# EAGLE design Autopilot Control Unit rev2 (EAGLE 9.6.2)
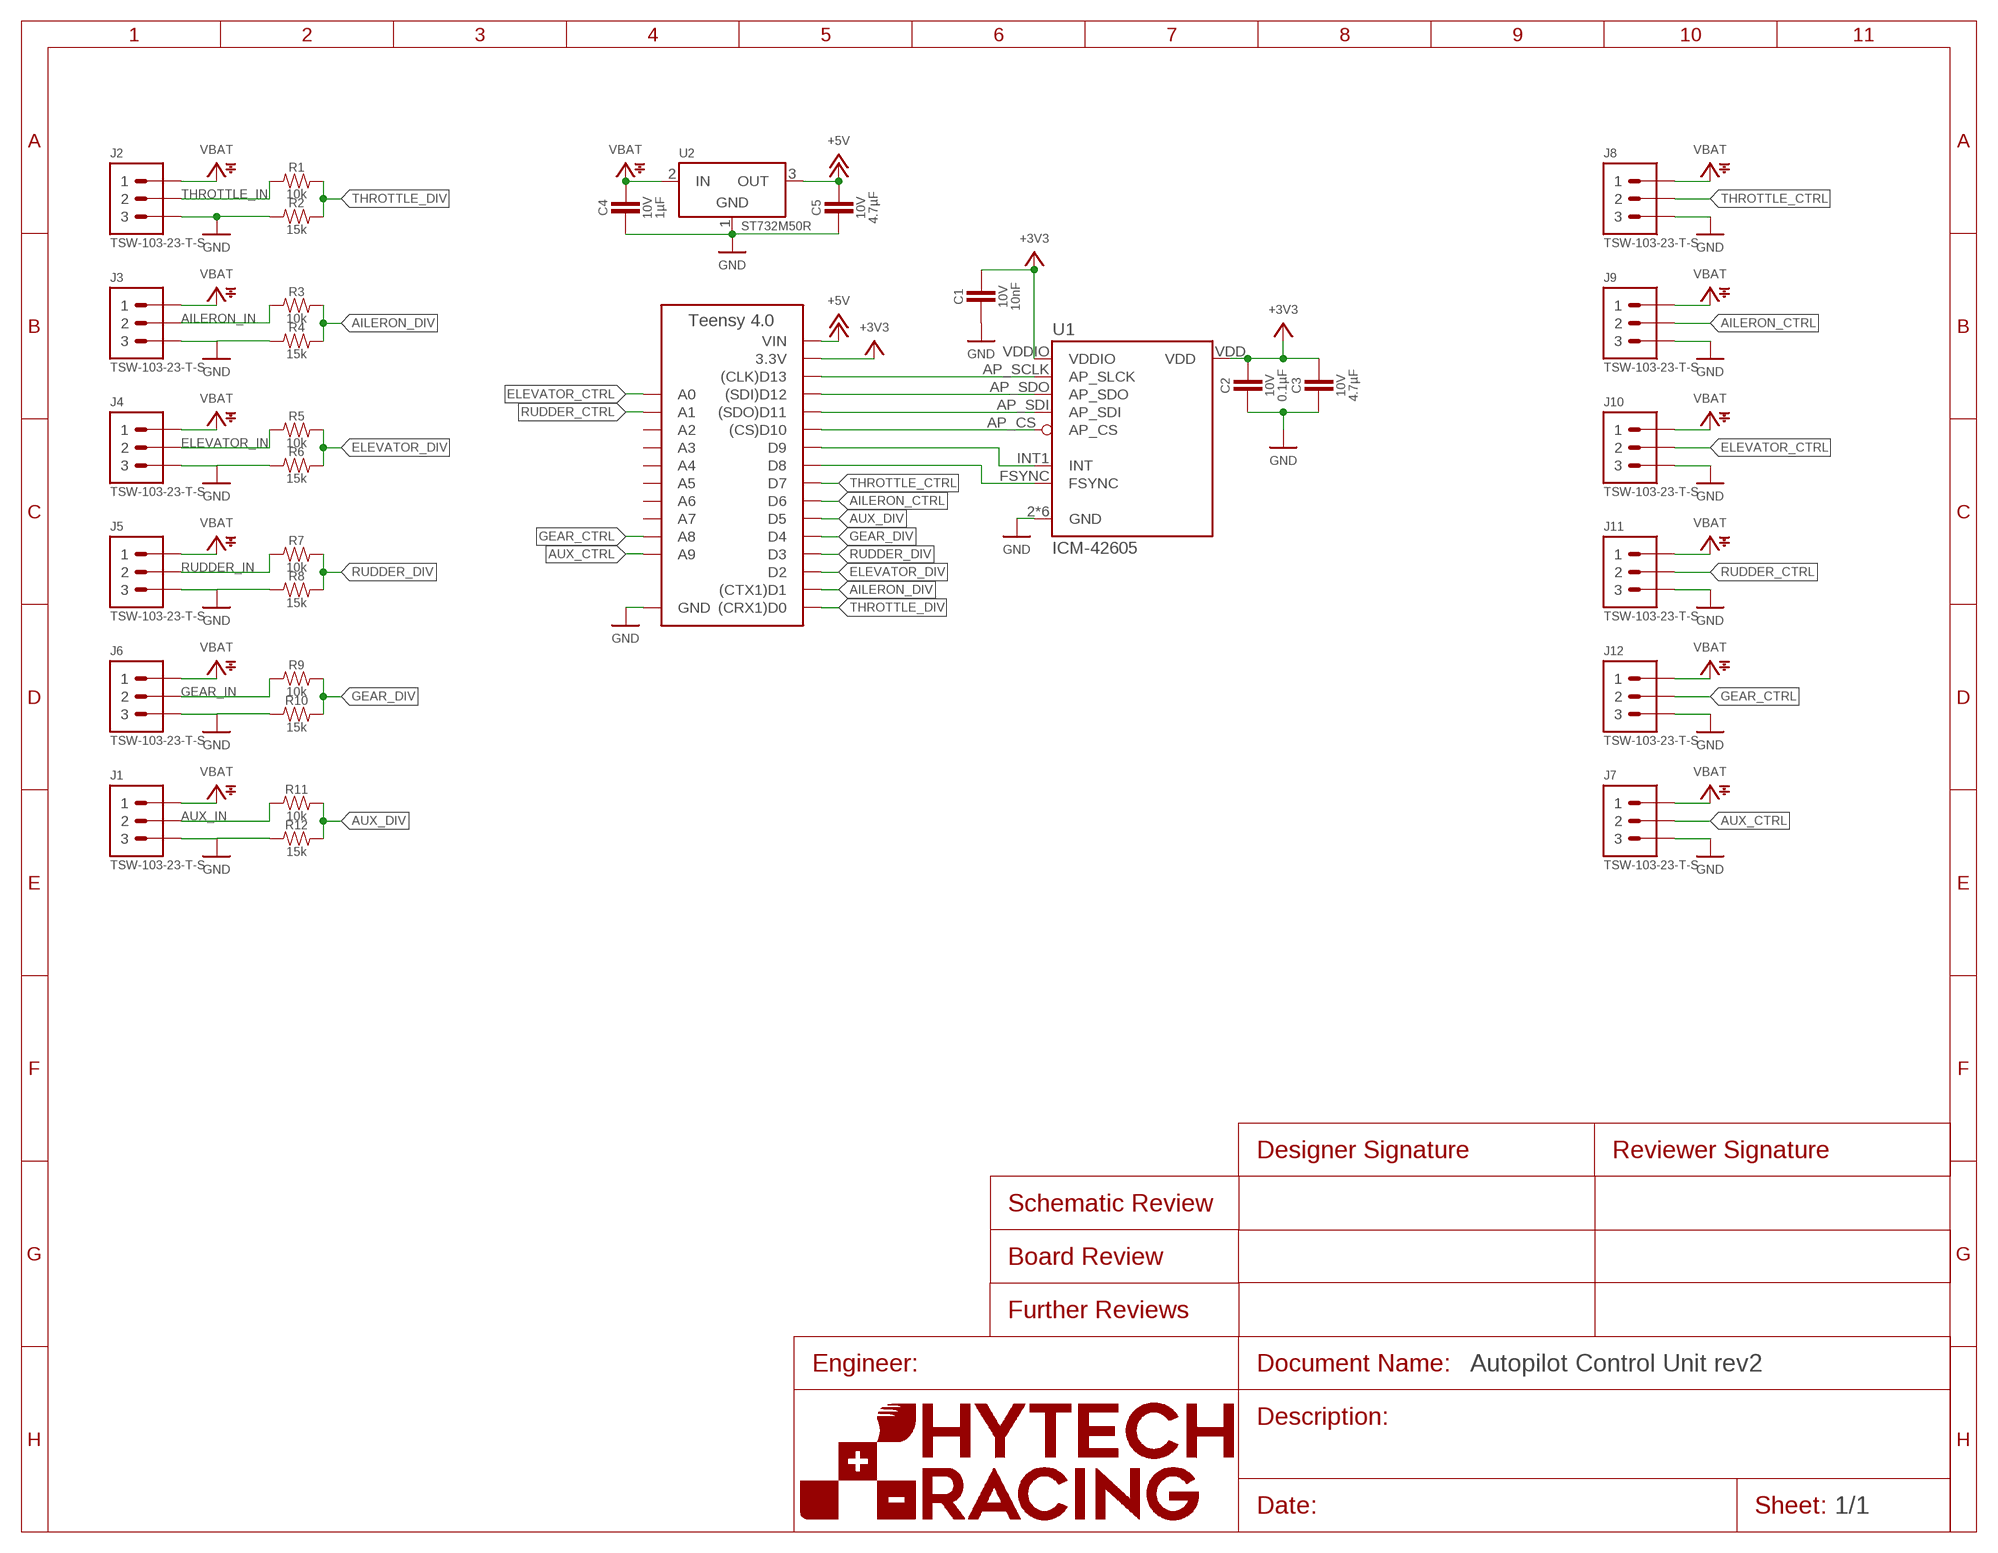
[diagram p0: schematic, sheet 1]

## Parts
A1  TEENSY_4.0  [TEENSY_SHORT]
C1  CAPACITOR_0603_10V_10NF  [0603-CAP]
C2  CAPACITOR_0603_10V_0.1UF  [0603-CAP]
C3  CAPACITOR_0603_10V_4.7UF  [0603-CAP]
C4  CAPACITOR_0603_10V_1UF  [0603-CAP]
C5  CAPACITOR_0603_10V_4.7UF  [0603-CAP]
J1  CONNECTOR_3__0.1"_INCH_TH  [0.1"_TH_HEADER]
J2  CONNECTOR_3__0.1"_INCH_TH  [0.1"_TH_HEADER]
J3  CONNECTOR_3__0.1"_INCH_TH  [0.1"_TH_HEADER]
J4  CONNECTOR_3__0.1"_INCH_TH  [0.1"_TH_HEADER]
J5  CONNECTOR_3__0.1"_INCH_TH  [0.1"_TH_HEADER]
J6  CONNECTOR_3__0.1"_INCH_TH  [0.1"_TH_HEADER]
J7  CONNECTOR_3__0.1"_INCH_TH  [0.1"_TH_HEADER]
J8  CONNECTOR_3__0.1"_INCH_TH  [0.1"_TH_HEADER]
J9  CONNECTOR_3__0.1"_INCH_TH  [0.1"_TH_HEADER]
J10  CONNECTOR_3__0.1"_INCH_TH  [0.1"_TH_HEADER]
J11  CONNECTOR_3__0.1"_INCH_TH  [0.1"_TH_HEADER]
J12  CONNECTOR_3__0.1"_INCH_TH  [0.1"_TH_HEADER]
R1  RESISTOR_0603_10K  [0603-RES]
R2  RESISTOR_0603_15K  [0603-RES]
R3  RESISTOR_0603_10K  [0603-RES]
R4  RESISTOR_0603_15K  [0603-RES]
R5  RESISTOR_0603_10K  [0603-RES]
R6  RESISTOR_0603_15K  [0603-RES]
R7  RESISTOR_0603_10K  [0603-RES]
R8  RESISTOR_0603_15K  [0603-RES]
R9  RESISTOR_0603_10K  [0603-RES]
R10  RESISTOR_0603_15K  [0603-RES]
R11  RESISTOR_0603_10K  [0603-RES]
R12  RESISTOR_0603_15K  [0603-RES]
U1  ICM-42605  [ICM-42605]
U2  VOLTAGE_REGULATOR_SOT-23-5_5V  [SOT-23-5]

## Nets
+3V3: A1.3.3V C1.1 C2.1 C3.1 U1.VDD U1.VDDIO
+5V: A1.VIN C5.1 U2.3(OUT)
AILERON_CTRL: A1.D6 J9.2
AILERON_DIV: A1.D1((CTX1)D1) R3.2 R4.2
AILERON_IN: J3.2 R3.1
AUX_CTRL: A1.D23(A9) J7.2
AUX_DIV: A1.D5 R11.2 R12.2
AUX_IN: J1.2 R11.1
ELEVATOR_CTRL: A1.D14(A0) J10.2
ELEVATOR_DIV: A1.D2 R5.2 R6.2
ELEVATOR_IN: J4.2 R5.1
GEAR_CTRL: A1.D22(A8) J12.2
GEAR_DIV: A1.D4 R9.2 R10.2
GEAR_IN: J6.2 R9.1
GND: A1.AGND/GND(GND) A1.GND C1.2 C2.2 C3.2 C4.2 C5.2 J1.3 J2.3 J3.3 J4.3 J5.3 J6.3 J7.3 J8.3 J9.3 J10.3 J11.3 J12.3 R2.1 R4.1 R6.1 R8.1 R10.1 R12.1 U1.2(GND) U1.3(GND) U1.7(GND) U1.10(GND) U1.11(GND) U1.GND U2.1(GND)
N$1: A1.D13((CLK)D13) U1.AP_SCLK(AP_SLCK)
N$2: A1.D12((SDI)D12) U1.AP_SDO
N$3: A1.D11((SDO)D11) U1.AP_SDI
N$4: A1.D10((CS)D10) U1.AP_CS
N$7: A1.D9 U1.INT1(INT)
N$8: A1.D8 U1.FSYNC
RUDDER_CTRL: A1.D15(A1) J11.2
RUDDER_DIV: A1.D3 R7.2 R8.2
RUDDER_IN: J5.2 R7.1
THROTTLE_CTRL: A1.D7 J8.2
THROTTLE_DIV: A1.D0((CRX1)D0) R1.2 R2.2
THROTTLE_IN: J2.2 R1.1
VBAT: C4.1 J1.1 J2.1 J3.1 J4.1 J5.1 J6.1 J7.1 J8.1 J9.1 J10.1 J11.1 J12.1 U2.2(IN)
Unconnected: A1.D16(A2) A1.D17(A3) A1.D18(A4) A1.D19(A5) A1.D20(A6) A1.D21(A7)

## Library data of the parts
A1 = HyTechDevices:TEENSY_4.0: Teensy 4.0 Datasheet <https://www.pjrc.com/store/teensy40.html> Requires ordering of: 2: 14 pin, 0.1" pitch female headers; TEENSY: 4.0
C1 = HyTechDevices:CAPACITOR_?_*: Capacitor, Non-Polarized VJ...1BC Series Datasheet <https://www.mouser.com/datasheet/2/427/vjw1bcbascomseries-1762447.pdf> Samsung Datasheet <https://www.mouser.com/datasheet/2/585/MLCC-1837944.pdf> Walsin Datasheet <https://www.mouser.com/datasheet/2/210/WTC_MLCC_General_Purpose-1534899.pdf> GRM188R61A226ME15D <https://www.mouser.com/datasheet/2/281/1/GRM188R61A226ME15_02A-1985787.pdf> GRM188R61E106MA73D <https://www.mouser.com/datasheet/2/281/1/GRM188R61E106MA73_01A-1985806.pdf> 885012006013 <https://www.mouser.com/datasheet/2/445/885012006013-1726946.pdf> 2220Y6300105KXTWS2 <https://www.mouser.com/datasheet/2/218/SMD_High_and_Std_StackiCap_P62-1825512.pdf> Yageo Class 2, X5R <https://www.mouser.com/datasheet/2/447/UPY_GPHC_X5R_4V_to_50V_26-1827097.pdf> TDK C Series <https://www.mouser.com/ProductDetail/TDK/C3216X5R1V226M160AC?qs=%2Fha2pyFadujbcx9jh7lYl%2F4NeMoXFhdc8AqVWNq4wW6M2y7zl6GzBuhgtI0ngznN> AVX Automotive MLCC <https://www.mouser.com/datasheet/2/40/AutoMLCC-777028.pdf> KEMET X7R Series <https://www.mouser.com/datasheet/2/212/KEM_C1002_X7R_SMD-1102033.pdf> Kyocera AVX <https://www.mouser.com/datasheet/2/40/C0GNP0_Dielectric-951274.pdf> GRM21BR61H <https://www.mouser.com/datasheet/2/281/1/GRM21BR61H106KE43_01A-1986884.pdf>; CAPACITANCE: 10nF; DKPN: 311-4054-1-ND; MANUFACTURER: Yageo; MOPN: 603-CC603KRX7R6BB103; MPN: CC0603KRX7R6BB103; TOLERANCE: 10%; VOLTAGE: 10V
C2 = HyTechDevices:CAPACITOR_?_*: Capacitor, Non-Polarized VJ...1BC Series Datasheet <https://www.mouser.com/datasheet/2/427/vjw1bcbascomseries-1762447.pdf> Samsung Datasheet <https://www.mouser.com/datasheet/2/585/MLCC-1837944.pdf> Walsin Datasheet <https://www.mouser.com/datasheet/2/210/WTC_MLCC_General_Purpose-1534899.pdf> GRM188R61A226ME15D <https://www.mouser.com/datasheet/2/281/1/GRM188R61A226ME15_02A-1985787.pdf> GRM188R61E106MA73D <https://www.mouser.com/datasheet/2/281/1/GRM188R61E106MA73_01A-1985806.pdf> 885012006013 <https://www.mouser.com/datasheet/2/445/885012006013-1726946.pdf> 2220Y6300105KXTWS2 <https://www.mouser.com/datasheet/2/218/SMD_High_and_Std_StackiCap_P62-1825512.pdf> Yageo Class 2, X5R <https://www.mouser.com/datasheet/2/447/UPY_GPHC_X5R_4V_to_50V_26-1827097.pdf> TDK C Series <https://www.mouser.com/ProductDetail/TDK/C3216X5R1V226M160AC?qs=%2Fha2pyFadujbcx9jh7lYl%2F4NeMoXFhdc8AqVWNq4wW6M2y7zl6GzBuhgtI0ngznN> AVX Automotive MLCC <https://www.mouser.com/datasheet/2/40/AutoMLCC-777028.pdf> KEMET X7R Series <https://www.mouser.com/datasheet/2/212/KEM_C1002_X7R_SMD-1102033.pdf> Kyocera AVX <https://www.mouser.com/datasheet/2/40/C0GNP0_Dielectric-951274.pdf> GRM21BR61H <https://www.mouser.com/datasheet/2/281/1/GRM21BR61H106KE43_01A-1986884.pdf>; CAPACITANCE: 0.1µF; DKPN: 720-1688-1-ND; MANUFACTURER: Vishay Vitramon; MOPN: 77-VJ0603Y104JXQPBC; MPN: VJ0603Y104JXQPW1BC; TOLERANCE: 5%; VOLTAGE: 10V
C3 C5 = HyTechDevices:CAPACITOR_?_*: Capacitor, Non-Polarized VJ...1BC Series Datasheet <https://www.mouser.com/datasheet/2/427/vjw1bcbascomseries-1762447.pdf> Samsung Datasheet <https://www.mouser.com/datasheet/2/585/MLCC-1837944.pdf> Walsin Datasheet <https://www.mouser.com/datasheet/2/210/WTC_MLCC_General_Purpose-1534899.pdf> GRM188R61A226ME15D <https://www.mouser.com/datasheet/2/281/1/GRM188R61A226ME15_02A-1985787.pdf> GRM188R61E106MA73D <https://www.mouser.com/datasheet/2/281/1/GRM188R61E106MA73_01A-1985806.pdf> 885012006013 <https://www.mouser.com/datasheet/2/445/885012006013-1726946.pdf> 2220Y6300105KXTWS2 <https://www.mouser.com/datasheet/2/218/SMD_High_and_Std_StackiCap_P62-1825512.pdf> Yageo Class 2, X5R <https://www.mouser.com/datasheet/2/447/UPY_GPHC_X5R_4V_to_50V_26-1827097.pdf> TDK C Series <https://www.mouser.com/ProductDetail/TDK/C3216X5R1V226M160AC?qs=%2Fha2pyFadujbcx9jh7lYl%2F4NeMoXFhdc8AqVWNq4wW6M2y7zl6GzBuhgtI0ngznN> AVX Automotive MLCC <https://www.mouser.com/datasheet/2/40/AutoMLCC-777028.pdf> KEMET X7R Series <https://www.mouser.com/datasheet/2/212/KEM_C1002_X7R_SMD-1102033.pdf> Kyocera AVX <https://www.mouser.com/datasheet/2/40/C0GNP0_Dielectric-951274.pdf> GRM21BR61H <https://www.mouser.com/datasheet/2/281/1/GRM21BR61H106KE43_01A-1986884.pdf>; CAPACITANCE: 4.7µF; DKPN: 1276-1044-1-ND; MANUFACTURER: Samsung Electro-Mechanics; MOPN: 187-CL10A475KP8NNNC; MPN: CL10A475KP8NNNC; TOLERANCE: 10%; VOLTAGE: 10V
C4 = HyTechDevices:CAPACITOR_?_*: Capacitor, Non-Polarized VJ...1BC Series Datasheet <https://www.mouser.com/datasheet/2/427/vjw1bcbascomseries-1762447.pdf> Samsung Datasheet <https://www.mouser.com/datasheet/2/585/MLCC-1837944.pdf> Walsin Datasheet <https://www.mouser.com/datasheet/2/210/WTC_MLCC_General_Purpose-1534899.pdf> GRM188R61A226ME15D <https://www.mouser.com/datasheet/2/281/1/GRM188R61A226ME15_02A-1985787.pdf> GRM188R61E106MA73D <https://www.mouser.com/datasheet/2/281/1/GRM188R61E106MA73_01A-1985806.pdf> 885012006013 <https://www.mouser.com/datasheet/2/445/885012006013-1726946.pdf> 2220Y6300105KXTWS2 <https://www.mouser.com/datasheet/2/218/SMD_High_and_Std_StackiCap_P62-1825512.pdf> Yageo Class 2, X5R <https://www.mouser.com/datasheet/2/447/UPY_GPHC_X5R_4V_to_50V_26-1827097.pdf> TDK C Series <https://www.mouser.com/ProductDetail/TDK/C3216X5R1V226M160AC?qs=%2Fha2pyFadujbcx9jh7lYl%2F4NeMoXFhdc8AqVWNq4wW6M2y7zl6GzBuhgtI0ngznN> AVX Automotive MLCC <https://www.mouser.com/datasheet/2/40/AutoMLCC-777028.pdf> KEMET X7R Series <https://www.mouser.com/datasheet/2/212/KEM_C1002_X7R_SMD-1102033.pdf> Kyocera AVX <https://www.mouser.com/datasheet/2/40/C0GNP0_Dielectric-951274.pdf> GRM21BR61H <https://www.mouser.com/datasheet/2/281/1/GRM21BR61H106KE43_01A-1986884.pdf>; CAPACITANCE: 1µF; DKPN: 311-1796-1-ND; MANUFACTURER: Yageo; MOPN: 603-CC603KRX7R6BB105; MPN: CC0603KRX7R6BB105; TOLERANCE: 10%; VOLTAGE: 10V
J1-J12 = Devices:CONNECTOR_3_?_*; MPN: TSW-103-23-T-S
R1 R3 R5 R7 R9 R11 = HyTechDevices:RESISTOR_?_*: Resistor PWR163 Series <https://www.mouser.com/datasheet/2/54/pwr163-777985.pdf> AC Series <https://www.mouser.com/datasheet/2/447/Yageo_PYu_AC_51_RoHS_L_7_1714230-1874691.pdf> PU Series <https://www.mouser.com/datasheet/2/447/PYu-PU_51_RoHS_L_6-1504619.pdf> ERA Series <https://www.mouser.com/datasheet/2/315/AOA0000C307-1149632.pdf> PWR263 Series <https://www.mouser.com/datasheet/2/54/pwr263s_35-778069.pdf> KTR Series <https://www.mouser.com/datasheet/2/348/ROHM_S_A0011075115_1-2563276.pdf> RC Series <https://www.mouser.com/datasheet/2/447/Yageo_03_18_2021_PYu_RC_Group_51_RoHS_L_11-2199992.pdf> ERJ PB3, PB6 Series <https://www.mouser.com/datasheet/2/315/AOA0000C328-1530132.pdf> ERJ PA2, P03, PA3, P06, P08, P14 Series <https://www.mouser.com/datasheet/2/315/AOA0000C331-1141874.pdf> B20 Series <https://www.ohmite.com/assets/docs/res_200.pdf?r=false> TE Connectivity/Holsworthy RN73 Series <https://www.mouser.com/datasheet/2/418/4/NG_DS_1773270_M-604713.pdf> Vishay Dale D/CRCW e3 <https://www.mouser.com/datasheet/2/427/dcrcwe3-1762152.pdf> Ohmite B20 <https://www.ohmite.com/assets/docs/res_200.pdf?r=false>; DKPN: 311-10.0KHRCT-ND; MANUFACTURER: Yageo; MOPN: 603-RC0603FR-0710KL; MPN: RC0603FR-0710KL; POWER: 0.1W; RESISTANCE: 10k; TOLERANCE: 1%; VOLTAGE_CONTINUOUS: 31.62V; VOLTAGE_MAX: 75V
R2 R4 R6 R8 R10 R12 = HyTechDevices:RESISTOR_?_*: Resistor PWR163 Series <https://www.mouser.com/datasheet/2/54/pwr163-777985.pdf> AC Series <https://www.mouser.com/datasheet/2/447/Yageo_PYu_AC_51_RoHS_L_7_1714230-1874691.pdf> PU Series <https://www.mouser.com/datasheet/2/447/PYu-PU_51_RoHS_L_6-1504619.pdf> ERA Series <https://www.mouser.com/datasheet/2/315/AOA0000C307-1149632.pdf> PWR263 Series <https://www.mouser.com/datasheet/2/54/pwr263s_35-778069.pdf> KTR Series <https://www.mouser.com/datasheet/2/348/ROHM_S_A0011075115_1-2563276.pdf> RC Series <https://www.mouser.com/datasheet/2/447/Yageo_03_18_2021_PYu_RC_Group_51_RoHS_L_11-2199992.pdf> ERJ PB3, PB6 Series <https://www.mouser.com/datasheet/2/315/AOA0000C328-1530132.pdf> ERJ PA2, P03, PA3, P06, P08, P14 Series <https://www.mouser.com/datasheet/2/315/AOA0000C331-1141874.pdf> B20 Series <https://www.ohmite.com/assets/docs/res_200.pdf?r=false> TE Connectivity/Holsworthy RN73 Series <https://www.mouser.com/datasheet/2/418/4/NG_DS_1773270_M-604713.pdf> Vishay Dale D/CRCW e3 <https://www.mouser.com/datasheet/2/427/dcrcwe3-1762152.pdf> Ohmite B20 <https://www.ohmite.com/assets/docs/res_200.pdf?r=false>; DKPN: P15KBDCT-ND; MANUFACTURER: Panasonic Electronic Components; MOPN: 667-ERA-3ARB153V; MPN: ERA-3ARB153V; POWER: 0.1W; RESISTANCE: 15k; TOLERANCE: 0.1%; VOLTAGE_CONTINUOUS: 38.73V; VOLTAGE_MAX: 75V
U1 = Devices:ICM-42605; MPN: ICM-42605
U2 = HyTechDevices:VOLTAGE_REGULATOR_?_*: Voltage Regulators LDL1117S50R Datasheet <https://www.mouser.com/datasheet/2/389/dm00366442-1799212.pdf> NCP785AH120T1G <https://www.mouser.com/datasheet/2/308/NCP785A_D-1812704.pdf> LMS8117A Datasheet <https://www.ti.com/lit/ds/symlink/lms8117a.pdf?HQS> ST732M50R Datasheet <https://www.mouser.com/datasheet/2/389/st732-1830546.pdf>; DKPN: 497-ST732M50RTR-ND; MANUFACTURER: STMicroelectronics; MOPN: 511-ST732M50R; MPN: ST732M50R

## Board
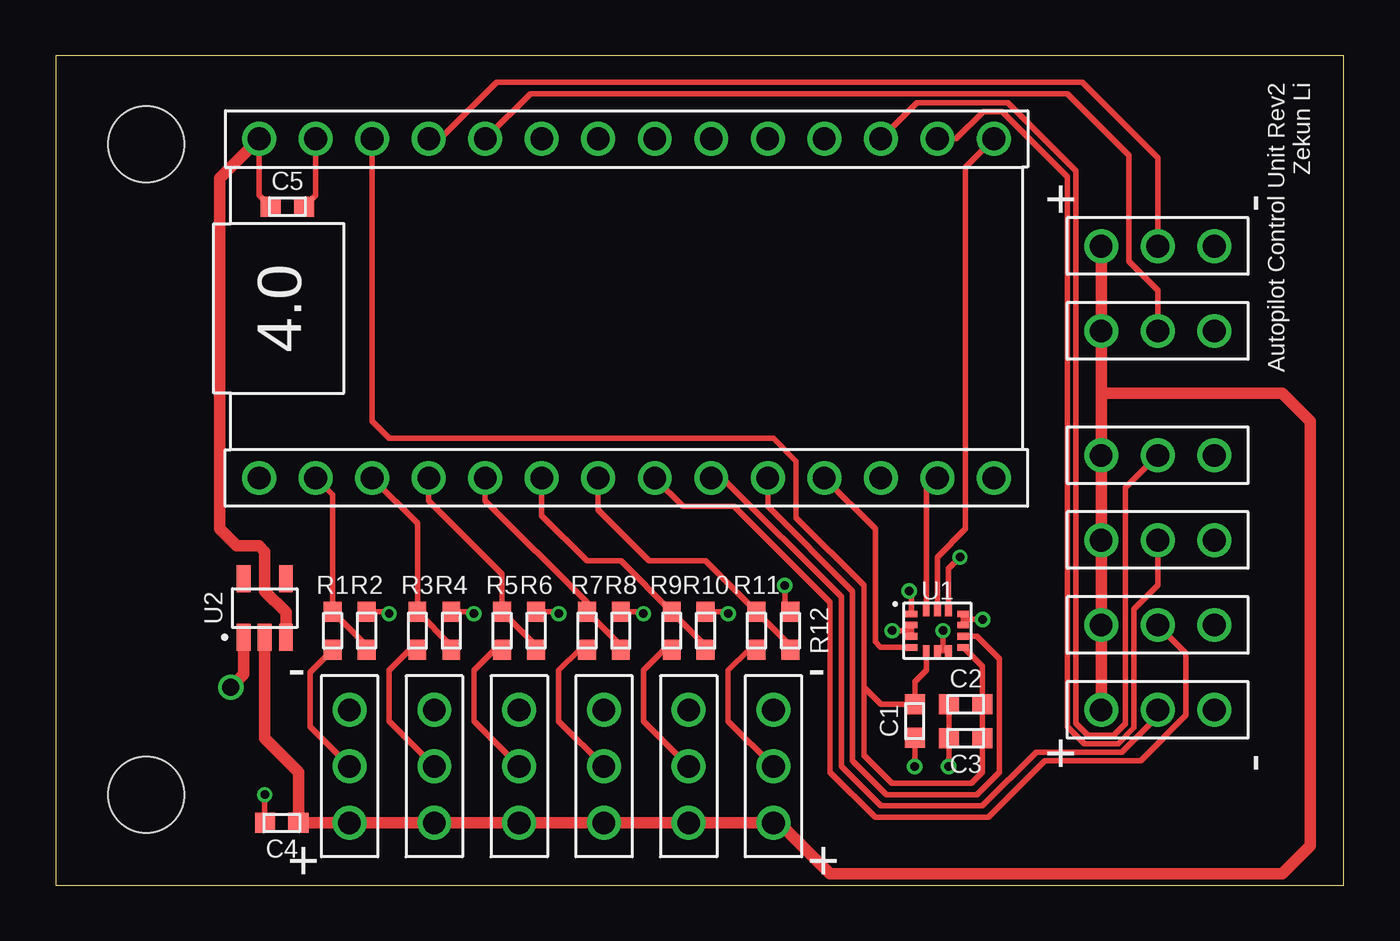
[diagram p1: board, top side]
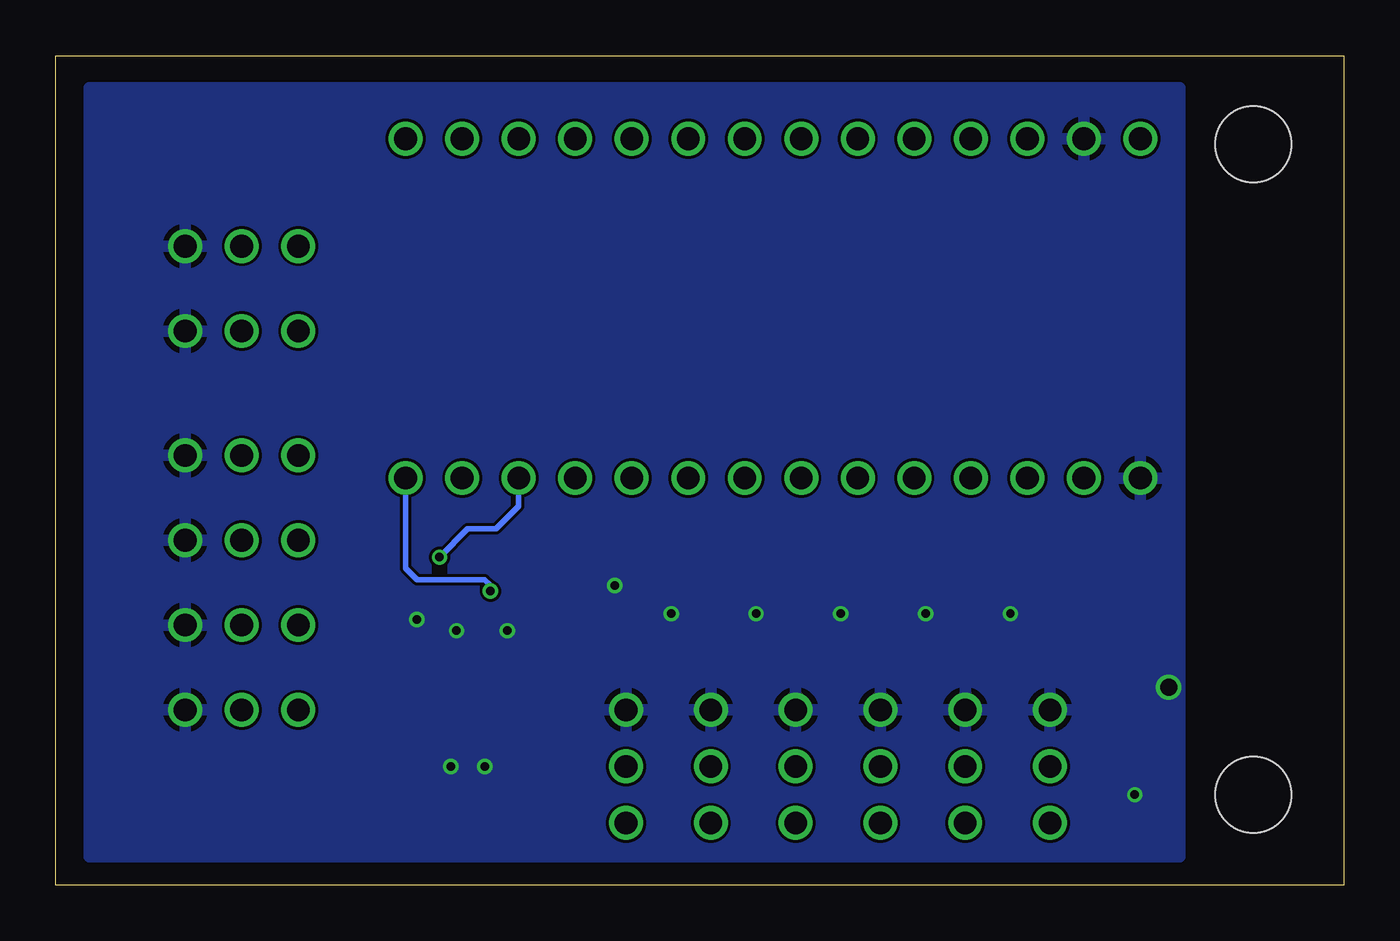
[diagram p2: board, bottom side, seen from below]

Size 57.89 x 37.26 mm. Coordinates in mm from the lower left corner, seen from the top.
Outline: 0,0 57.89,0 57.89,37.26 0,37.26 0,0
Copper layers (1*16): Top 0.035mm / dielectric 1.53mm / Bottom 0.035mm
Design rules "JLCPCB (2 Layer)": minimum track width 5mil, minimum drill 0.3mm, track to track 5mil, track to pad 5mil, pad to pad 5mil, via to via 20mil, smd to smd 5mil, copper to edge 0.2mm, drill to drill 21mil, minimum pad ring 6mil, minimum via ring 6mil, stop-mask expansion 6mil, vias tented up to drill 30mil, thermal gap 10mil

### Footprints (pad centres in the part's own frame; a part is rotated, then mirrored left to right if it is on the bottom)
TEENSY_SHORT = drill 1.016: 3.3V 0,5.08; AGND/GND 0,2.54; D0 15.24,2.54; D1 15.24,5.08; D2 15.24,7.62; D3 15.24,10.16; D4 15.24,12.7; D5 15.24,15.24; D6 15.24,17.78; D7 15.24,20.32; D8 15.24,22.86; D9 15.24,25.4; D10 15.24,27.94; D11 15.24,30.48; D12 15.24,33.02; D13 0,33.02; D14 0,30.48; D15 0,27.94; D16 0,25.4; D17 0,22.86; D18 0,20.32; D19 0,17.78; D20 0,15.24; D21 0,12.7; D22 0,10.16; D23 0,7.62; GND 15.24,0; VIN 0,0
0603-CAP = smd 0.9 x 0.9: 1 -0.75,0; 2 0.75,0
0.1"_TH_HEADER = drill 1.016: 1 0,2.54; 2 0,0; 3 0,-2.54
0603-RES = smd 0.9 x 0.8: 1 -0.85,0; 2 0.85,0
ICM-42605 = smd 0.525 x 0.3: 2 -1.163,0.25; 3 -1.163,-0.25; 10 1.163,0.25; 11 1.163,0.75; AP_SDO -1.163,0.75; FSYNC 1.163,-0.25; INT1 -1.163,-0.75; VDD 1.163,-0.75 | smd 0.3 x 0.525: 7 0.5,-0.912; AP_CS 0.5,0.912; AP_SCLK 0,0.912; AP_SDI -0.5,0.912; GND 0,-0.912; VDDIO -0.5,-0.912
SOT-23-5 = smd 0.62 x 1.22: 1 -0.95,-1.31; 2 0,-1.31; 3 0.95,-1.31; 4 0.95,1.31; 5 -0.95,1.31
MOUNTING_M3 = hole 3.4: 0,0

### Placement (x,y rotation side)
A1  9.14,33.53 270 top
C1  38.61,7.37 270 top
C2  40.89,8.13 180 top
C3  40.89,6.6 180 top
C4  10.16,2.79 180 top
C5  10.41,30.48 0 top
J1  32.26,5.33 180 top
J2  13.21,5.33 180 top
J3  17.02,5.33 180 top
J4  20.83,5.33 180 top
J5  24.64,5.33 180 top
J6  28.45,5.33 180 top
J7  49.53,28.7 90 top
J8  49.53,7.87 90 top
J9  49.53,11.68 90 top
J10  49.53,15.49 90 top
J11  49.53,19.3 90 top
J12  49.53,24.89 90 top
R1  12.45,11.43 90 top
R2  13.97,11.43 270 top
R3  16.26,11.43 90 top
R4  17.78,11.43 270 top
R5  20.07,11.43 90 top
R6  21.59,11.43 270 top
R7  23.88,11.43 90 top
R8  25.4,11.43 270 top
R9  27.69,11.43 90 top
R10  29.21,11.43 270 top
R11  31.5,11.43 90 top
R12  33.02,11.43 270 top
U1  39.62,11.43 0 top
U2  9.4,12.45 0 top
U$1  [MOUNTING_M3]  4.06,4.06 0 top
U$2  [MOUNTING_M3]  4.06,33.27 0 top

### Tracks (layer width: path | path; a pad name or v marks a point on that pad's centre or on a via)
+3V3
  Top 0.254: U1.VDDIO 39.12,9.65 38.61,9.13 C1.1 37.1,8.12 36.32,8.89 | U1.VDD 41.64,9.82 C2.1 C3.1 41.64,5.07 41.15,4.57 37.59,4.57 36.32,5.84 36.32,8.89 | A1.3.3V 14.22,20.83 14.99,20.07 32.26,20.07 33.27,19.05 33.27,16.51 36.32,13.46 36.32,8.89
+5V
  Top 0.254: A1.VIN 9.14,31 C5.1
  Top 0.508: U2.3 10.35,12.26 9.4,13.21 9.4,14.99 9.14,15.24 8.13,15.24 7.37,16 7.37,31.75 A1.VIN
AILERON_CTRL
  Top 0.254: A1.D6 28.19,17.02 30.48,17.02 34.8,12.7 34.8,5.08 36.83,3.05 41.91,3.05 44.45,5.59 48.77,5.59 50.8,7.62 50.8,10.41 J9.2
AILERON_DIV
  Top 0.254: R4.2 17.78,10.76 R3.2 16.26,16.26 A1.D1
AILERON_IN
  Top 0.254: R3.1 15.91,10.58 14.99,9.65 14.99,7.37 J3.2
AUX_CTRL
  Top 0.254: A1.D23 17.27,33.53 19.81,36.07 46.14,36.07 49.53,32.68 J7.2
AUX_DIV
  Top 0.254: R12.2 33.02,10.76 R11.2 29.21,14.57 26.67,14.57 24.38,16.85 A1.D5
AUX_IN
  Top 0.254: J1.2 30.23,7.37 30.23,9.65 31.15,10.58 R11.1
ELEVATOR_CTRL
  Top 0.254: A1.D14 40.46,33.53 41.68,34.75 42.55,34.75 45.47,31.83 45.47,7.11 46.23,6.35 47.75,6.35 48.46,7.06 48.46,12.39 49.53,13.46 J10.2
ELEVATOR_DIV
  Top 0.254: R6.2 21.59,10.76 R5.2 20.07,13.97 16.76,17.27 A1.D2
ELEVATOR_IN
  Top 0.254: J4.2 18.8,7.37 18.8,9.65 19.72,10.58 R5.1
GEAR_CTRL
  Top 0.254: A1.D22 21.34,35.56 45.47,35.56 48.23,32.79 48.23,28.02 49.53,26.72 J12.2
GEAR_DIV
  Top 0.254: R10.2 29.21,10.76 R9.2 25.4,14.57 23.88,14.57 21.84,16.6 A1.D4
GEAR_IN
  Top 0.254: J6.2 26.42,7.37 26.42,9.65 27.34,10.58 R9.1
GND  (via drill 0.38, 0.76)
  Top 0.254: R2.1 14.9,12.28 v14.99,12.19 | R4.1 18.71,12.28 v18.8,12.19 | R6.1 22.52,12.28 v22.61,12.19 | R8.1 26.33,12.28 v26.42,12.19 | R10.1 30.14,12.28 v30.23,12.19 | v32.77,13.46 32.77,12.53 R12.1 | U1.2 38.46,11.43 | 38.46,11.43 U1.3 | U1.10 40.79,11.94 | 40.79,11.94 U1.11 | 40.79,11.94 v41.66,11.94 | 38.46,11.43 v37.59,11.43 | C2.2 C3.2 40.14,5.35 v40.13,5.33 | U1.GND 39.88,10.52 | 39.88,10.52 U1.7 | 39.88,10.52 v39.88,11.43 | C4.2 9.4,2.81 v9.4,4.06 | C5.2 11.68,31 A1.AGND/GND | C1.2 v38.61,5.33
  Top 0.508: U2.1 8.45,9.46 v7.87,8.89
  pour Bottom: 7.37,35.81 7.37,1.27 56.39,1.27 56.39,35.81
N$1
  Top 0.254: U1.AP_SCLK 39.62,14.73 40.89,16 40.89,32.26 A1.D13
N$2  (via drill 0.38)
  Top 0.254: U1.AP_SDO 38.46,13.1 v38.35,13.21
  Bottom 0.254: v38.35,13.21 38.35,13.46 38.61,13.72 41.66,13.72 42.16,14.22 A1.D12
N$3
  Top 0.254: U1.AP_SDI 39.12,17.79 A1.D11
N$4  (via drill 0.38)
  Top 0.254: U1.AP_CS 40.12,14.22 v40.64,14.73
  Bottom 0.254: v40.64,14.73 39.37,16 38.1,16 37.08,17.02 A1.D10
N$7
  Top 0.254: U1.INT1 37.07,10.68 36.83,10.92 36.83,16 A1.D9
N$8
  Top 0.254: A1.D8 32,17.02 35.81,13.21 35.81,5.59 37.34,4.06 41.4,4.06 42.42,5.08 42.42,10.16 41.4,11.18 U1.FSYNC
RUDDER_CTRL
  Top 0.254: A1.D15 38.71,35.15 42.79,35.15 45.85,32.09 45.85,7.28 46.39,6.73 47.56,6.73 48.08,7.25 48.08,17.86 J11.2
RUDDER_DIV
  Top 0.254: R8.2 25.4,10.76 R7.2 23.88,12.7 19.3,17.27 A1.D3
RUDDER_IN
  Top 0.254: J5.2 22.61,7.37 22.61,9.65 23.53,10.58 R7.1
THROTTLE_CTRL
  Top 0.254: A1.D7 29.97,18.29 35.31,12.95 35.31,5.33 37.08,3.56 41.66,3.56 44.07,5.97 47.91,5.97 49.53,7.59 J8.2
THROTTLE_DIV
  Top 0.254: R2.2 13.97,10.76 R1.2 12.45,17.53 A1.D0
THROTTLE_IN
  Top 0.254: R1.1 11.43,9.56 11.43,7.11 J2.2
VBAT
  Top 0.508: U2.2 9.4,6.6 10.92,5.08 10.92,2.81 C4.1 J2.1 J3.1 J4.1 J5.1 J6.1 J1.1 32.51,2.79 34.8,0.51 55.12,0.51 56.39,1.78 56.39,20.83 55.12,22.1 46.99,22.1 | J7.1 J12.1 46.99,22.1 | 46.99,22.1 J11.1 J10.1 J9.1 J8.1

### Text on the board
tNames: Autopilot Control Unit Rev2 / Zekun Li | + | - | - | - | + | - | + | +